# Altium schematic sheet system_electric_diagram_#3.SchDoc
size A4
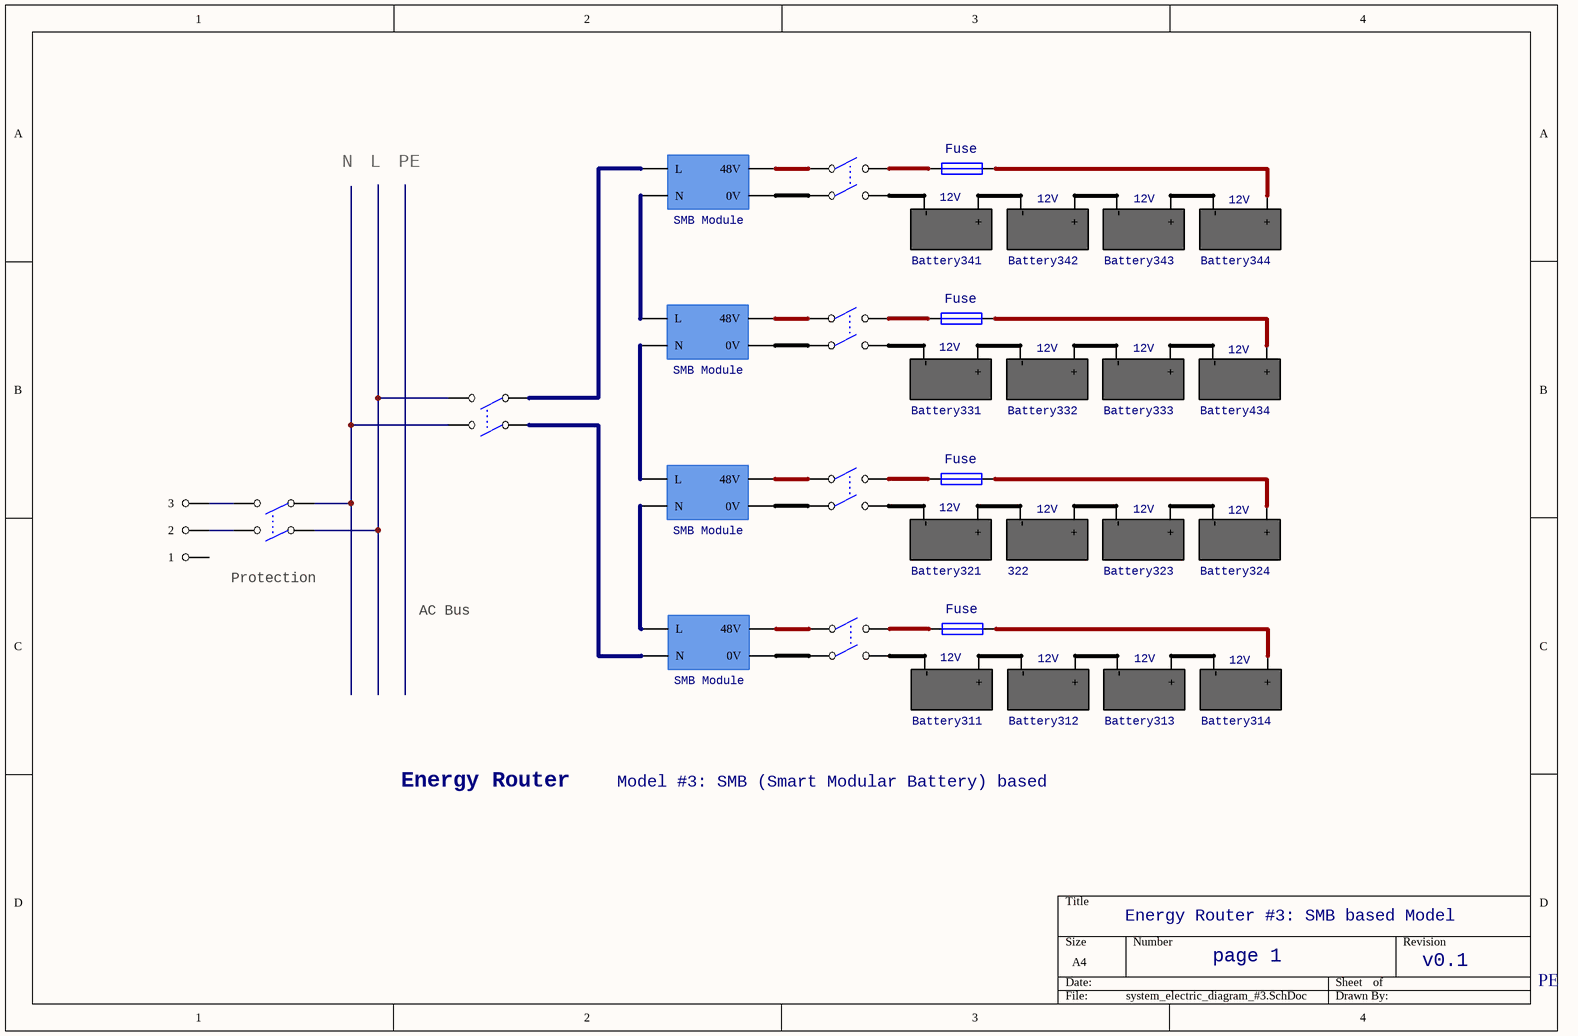
[diagram p0: system_electric_diagram_#3.SchDoc]

## Parts
322  12V
Battery311  12V
Battery312  12V
Battery313  12V
Battery314  12V
Battery321  12V
Battery323  12V
Battery324  12V
Battery331  12V
Battery332  12V
Battery333  12V
Battery341  12V
Battery342  12V
Battery343  12V
Battery344  12V
Battery434  12V
F301  Fuse  [FUSE1]
F302  Fuse  [FUSE1]
F303  Fuse  [FUSE1]
F304  Fuse  [FUSE1]
JP301  3 HEADER  (value not drawn)
K301  Switch  (value not drawn)
K302  Switch  (value not drawn)
K303  Switch  (value not drawn)
K304  Switch  (value not drawn)
K305  Switch  (value not drawn)
K306  Switch  (value not drawn)
U301  SMB Module
U402  SMB Module
U403  SMB Module
U404  SMB Module

## Nets
Net322_1: 322.1(-) Battery321.2(+)
Net322_2: 322.2(+) Battery323.1(-)
NetBattery311_1: Battery311.1(-) K301.4
NetBattery311_2: Battery311.2(+) Battery312.1(-)
NetBattery312_2: Battery312.2(+) Battery313.1(-)
NetBattery313_2: Battery313.2(+) Battery314.1(-)
NetBattery314_2: Battery314.2(+) F301.2
NetBattery321_1: Battery321.1(-) K302.4
NetBattery323_2: Battery323.2(+) Battery324.1(-)
NetBattery324_2: Battery324.2(+) F302.2
NetBattery331_1: Battery331.1(-) K303.4
NetBattery331_2: Battery331.2(+) Battery332.1(-)
NetBattery332_2: Battery332.2(+) Battery333.1(-)
NetBattery333_2: Battery333.2(+) Battery434.1(-)
NetBattery341_1: Battery341.1(-) K304.4
NetBattery341_2: Battery341.2(+) Battery342.1(-)
NetBattery342_2: Battery342.2(+) Battery343.1(-)
NetBattery343_2: Battery343.2(+) Battery344.1(-)
NetBattery344_2: Battery344.2(+) F304.2
NetBattery434_2: Battery434.2(+) F303.2
NetF301_1: F301.1 K301.2
NetF302_1: F302.1 K302.2
NetF303_1: F303.1 K303.2
NetF304_1: F304.1 K304.2
NetJP301_2: JP301.2 K306.2
NetJP301_3: JP301.3 K306.4
NetK301_1: K301.1 U301.5(48V)
NetK301_3: K301.3 U301.4(0V)
NetK302_1: K302.1 U402.5(48V)
NetK302_3: K302.3 U402.4(0V)
NetK303_1: K303.1 U403.5(48V)
NetK303_3: K303.3 U403.4(0V)
NetK304_1: K304.1 U404.5(48V)
NetK304_3: K304.3 U404.4(0V)
NetK305_1: K305.1 U301.1(N)
NetK305_2: K305.2 K306.3
NetK305_3: K305.3 U404.2(L)
NetK305_4: K305.4 K306.1
NetU301_2: U301.2(L) U402.1(N)
NetU402_2: U402.2(L) U403.1(N)
NetU403_2: U403.2(L) U404.1(N)

Not connected (* = marked no-connect by the designer): JP301 1

## Notes on the sheet
- N
- L
- PE
- Protection
- AC Bus
- Energy Router
- Model #3: SMB (Smart Modular Battery) based
- Energy Router #3: SMB based Model
- page 1
- v0.1

## Library data of the parts
322 Battery311-Battery314 Battery321 Battery323 Battery324 Battery331-Battery333 Battery341-Battery344 Battery434 = 1_BAT_12V
JP301 = 3 HEADER: 3 Pin Header
K301-K306 = SW-DPST
U301 U402-U404 = 20_SMB_Module